# EAGLE schematic ESP_DRIVE (EAGLE 9.6.2)
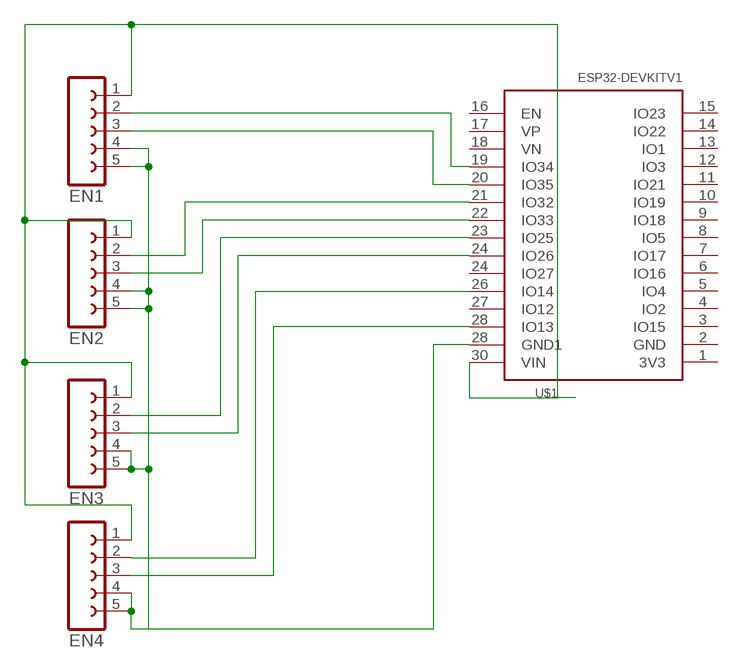
[diagram p0: schematic, sheet 1]

## Parts
EN1  FE05-1  [FE05-1]
EN2  FE05-1  [FE05-1]
EN3  FE05-1  [FE05-1]
EN4  FE05-1  [FE05-1]
U$1  ESP32DEVKITV1  [ESP32-DEVKITV1]

## Nets
N$1: EN1.1 EN2.1 EN3.1 EN4.1 U$1.30(VIN)
N$2: EN1.4 EN1.5 EN2.4 EN2.5 EN3.4 EN3.5 EN4.4 EN4.5 U$1.28(GND1)
N$3: EN1.2 U$1.19(IO34)
N$4: EN1.3 U$1.20(IO35)
N$5: EN2.2 U$1.21(IO32)
N$6: EN2.3 U$1.22(IO33)
N$7: EN3.2 U$1.23(IO25)
N$8: EN3.3 U$1.24(IO26)
N$9: EN4.2 U$1.26(IO14)
N$10: EN4.3 U$1.28(IO13)
Unconnected: U$1.1(3V3) U$1.2(GND) U$1.3(IO15) U$1.4(IO2) U$1.5(IO4) U$1.6(IO16) U$1.7(IO17) U$1.8(IO5) U$1.9(IO18) U$1.10(IO19) U$1.11(IO21) U$1.12(IO3) U$1.13(IO1) U$1.14(IO22) U$1.15(IO23) U$1.16(EN) U$1.17(VP) U$1.18(VN) U$1.24(IO27) U$1.27(IO12)

## Library data of the parts
EN1-EN4 = con-lsta:FE05-1: FEMALE HEADER; OC_FARNELL: unknown; OC_NEWARK: unknown
U$1 = ESP32-DEVKITV1:ESP32DEVKITV1